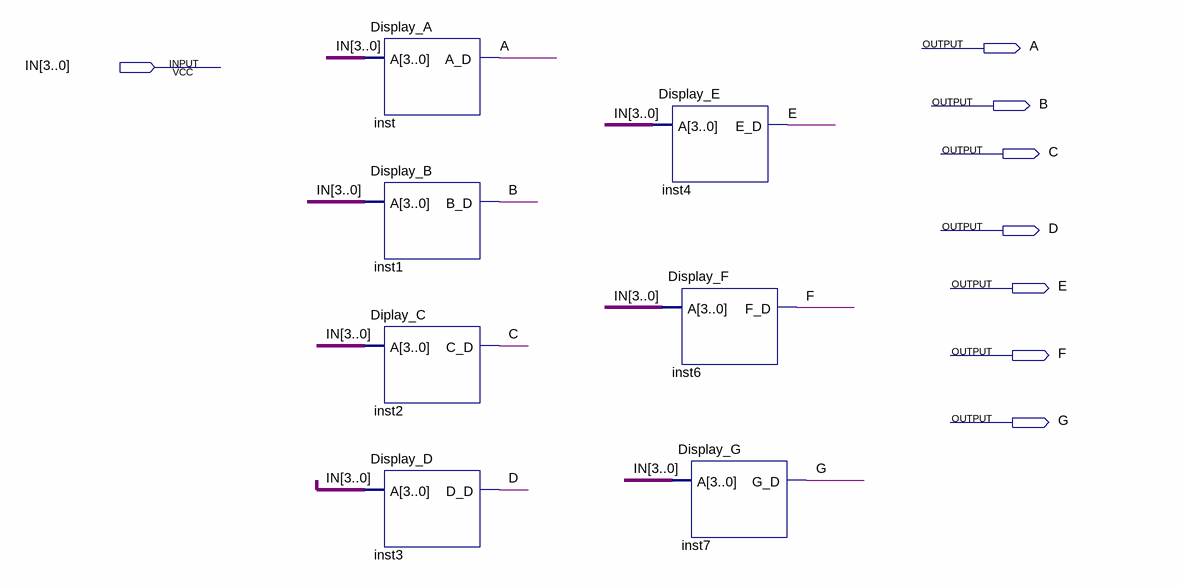
[diagram p0: schematic sheet]
// Quartus schematic Display7.bdf as structural Verilog: 7 symbols, 8 pins
module Display7 (
  input  [3:0] IN,
  output A,
  output B,
  output C,
  output D,
  output E,
  output F,
  output G
);

  Display_A inst (.A(IN), .A_D(A));
  Display_B inst1 (.A(IN), .B_D(B));
  Diplay_C inst2 (.A(IN), .C_D(C));
  Display_D inst3 (.A(IN), .D_D(D));
  Display_E inst4 (.A(IN), .E_D(E));
  Display_F inst6 (.A(IN), .F_D(F));
  Display_G inst7 (.A(IN), .G_D(G));
endmodule
